# EAGLE design maple-jtagadapter (EAGLE 5.10)
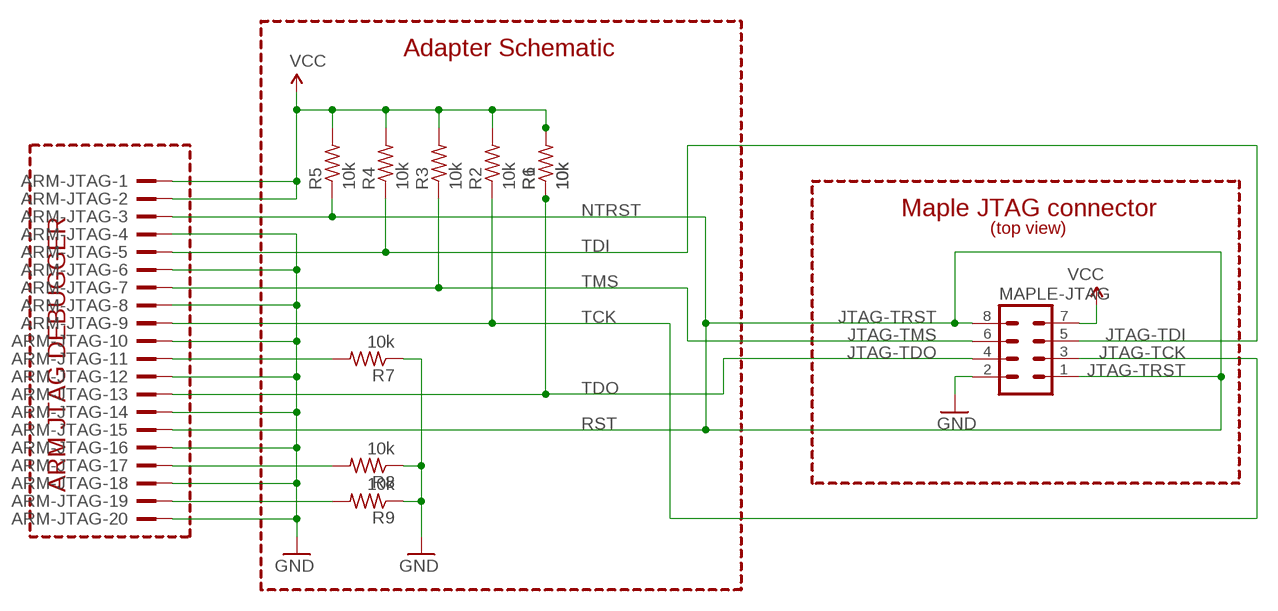
[diagram p0: schematic, sheet 1]

## Parts
ARM-JTAG  2520-  [PAK100/2500-20]
MAPLE-JTAG  MA04-2  [MA04-2]
R1  10k  R-US_0207/10  [0207/10]
R2  10k  R-US_0207/10  [0207/10]
R3  10k  R-US_0207/10  [0207/10]
R4  10k  R-US_0207/10  [0207/10]
R5  10k  R-US_0207/10  [0207/10]
R6  10k  R-US_0207/10  [0207/10]
R7  10k  R-US_0207/10  [0207/10]
R8  10k  R-US_0207/10  [0207/10]
R9  10k  R-US_0207/10  [0207/10]

## Nets
GND [vcc]: ARM-JTAG.4 ARM-JTAG.6 ARM-JTAG.8 ARM-JTAG.10 ARM-JTAG.12 ARM-JTAG.14 ARM-JTAG.16 ARM-JTAG.18 ARM-JTAG.20 MAPLE-JTAG.2 R7.1 R8.1 R9.1
JTAG-TCK: ARM-JTAG.9 MAPLE-JTAG.3 R2.1
JTAG-TDI: ARM-JTAG.5 MAPLE-JTAG.5 R4.1
JTAG-TDO: ARM-JTAG.13 MAPLE-JTAG.4 R1.1 R6.1
JTAG-TMS: ARM-JTAG.7 MAPLE-JTAG.6 R3.1
JTAG-TRST: ARM-JTAG.3 ARM-JTAG.15 MAPLE-JTAG.1 MAPLE-JTAG.8 R5.1
N$140: ARM-JTAG.11 R7.2
N$141: ARM-JTAG.17 R8.2
N$142: ARM-JTAG.19 R9.2
VCC: ARM-JTAG.1 ARM-JTAG.2 MAPLE-JTAG.7 R1.2 R2.2 R3.2 R4.2 R5.2 R6.2

## Notes on the sheet
- Adapter Schematic
- ARM JTAG DEBUGGER | NTRST | Maple JTAG connector
- (top view)
- TDI
- TMS
- TCK
- TDO
- RST

## Library data of the parts
ARM-JTAG = con-3m:2520-: 3M (TM) Pak 100 4-Wall Header Source: 3M
MAPLE-JTAG = con-lstb:MA04-2: PIN HEADER
R1-R9 = resistor:R-US_: RESISTOR, American symbol

## Net classes
0 default: width 0.203 mm
1 vcc: width 0.254 mm

## Board
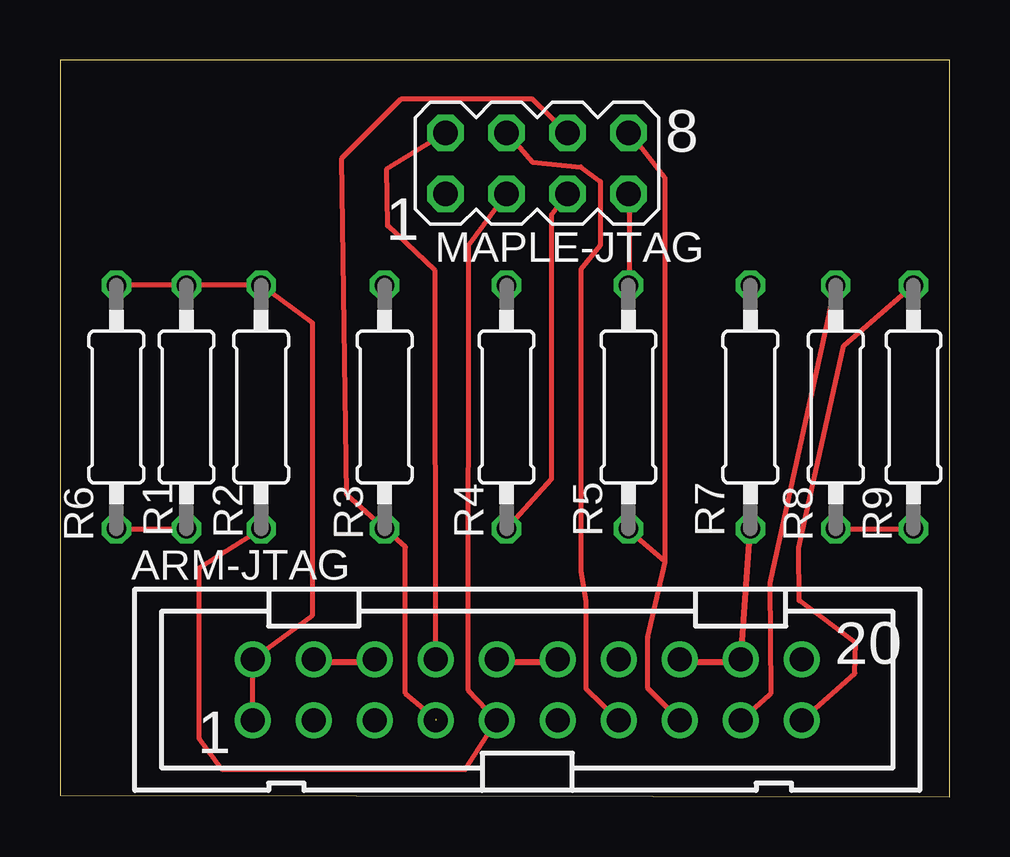
[diagram p1: board, top side]
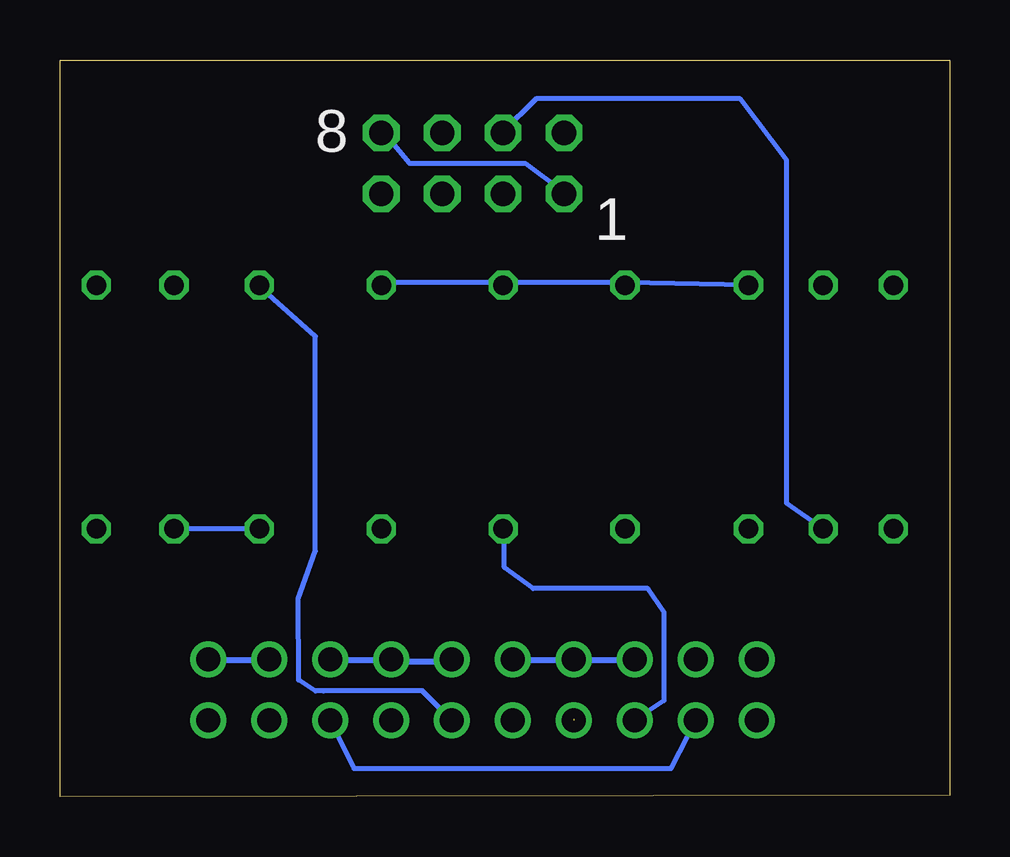
[diagram p2: board, bottom side, seen from below]

Size 37.07 x 30.72 mm. Coordinates in mm from the lower left corner, seen from the top.
Outline: 0,0.06 37.07,0 37.07,30.72 0,30.72 0,0.06
Copper layers (1*16): Top 0.0356mm / dielectric 1.5011mm / Bottom 0.0356mm
Design rules "LaenPCBOrder": minimum track width 6mil, minimum drill 13mil, track to track 6mil, track to pad 6mil, pad to pad 6mil, via to via 6mil, smd to smd 6mil, copper to edge 15mil, drill to drill 6mil, minimum pad ring 7mil, minimum via ring 7mil, stop-mask expansion 4mil, vias tented up to drill 0mil, thermal gap 10mil

### Footprints (pad centres in the part's own frame; a part is rotated, then mirrored left to right if it is on the bottom)
PAK100/2500-20 = drill 1 pad 1.422 round: 1 -11.43,-1.27; 2 -11.43,1.27; 3 -8.89,-1.27; 4 -8.89,1.27; 5 -6.35,-1.27; 6 -6.35,1.27; 7 -3.81,-1.27; 8 -3.81,1.27; 9 -1.27,-1.27; 10 -1.27,1.27; 11 1.27,-1.27; 12 1.27,1.27; 13 3.81,-1.27; 14 3.81,1.27; 15 6.35,-1.27; 16 6.35,1.27; 17 8.89,-1.27; 18 8.89,1.27; 19 11.43,-1.27; 20 11.43,1.27
MA04-2 = drill 1.016 octagon: 1 -3.81,-1.27; 2 -3.81,1.27; 3 -1.27,-1.27; 4 -1.27,1.27; 5 1.27,-1.27; 6 1.27,1.27; 7 3.81,-1.27; 8 3.81,1.27
0207/10 = drill 0.813 octagon: 1 -5.08,0; 2 5.08,0

### Placement (x,y rotation side)
ARM-JTAG  19.47,4.47 0 top
MAPLE-JTAG  19.88,26.42 0 top
R1  5.27,16.26 90 top
R2  8.38,16.26 90 top
R3  13.53,16.26 90 top
R4  18.61,16.26 90 top
R5  23.69,16.26 90 top
R6  2.35,16.26 90 top
R7  28.77,16.26 90 top
R8  32.32,16.26 90 top
R9  35.56,16.26 90 top

### Tracks (layer width: path | path; a pad name or v marks a point on that pad's centre or on a via)
GND
  Top 0.203: MAPLE-JTAG.2 13.61,26.18 13.65,23.82 15.63,21.93 ARM-JTAG.8 | R8.1 R9.1
  Top 0.254: 28.36,5.64 25.92,5.64 ARM-JTAG.16 | ARM-JTAG.4 10.68,5.64 13.12,5.64 ARM-JTAG.6 | ARM-JTAG.12 20.54,5.64 18.5,5.64 ARM-JTAG.10 | 28.36,5.64 R7.1 | 28.36,5.64 ARM-JTAG.18
  Bottom 0.203: R7.1 R8.1
  Bottom 0.254: ARM-JTAG.16 25.79,5.69 23.36,5.69 ARM-JTAG.14 23.2,5.63 20.76,5.63 ARM-JTAG.12 | ARM-JTAG.20 30.82,5.69 28.38,5.69 ARM-JTAG.18 | ARM-JTAG.10 18.17,5.69 15.74,5.69 ARM-JTAG.8 15.58,5.69 13.14,5.69 ARM-JTAG.6
JTAG-TCK
  Top 0.203: R2.1 5.8,9.55 5.8,2.43 6.73,1.16 16.89,1.14 ARM-JTAG.9 17.02,4.45 17.03,23 MAPLE-JTAG.3
JTAG-TDI
  Top 0.203: 18.71,11.23 R4.1 20.49,13.26 20.49,24.28 MAPLE-JTAG.5
  Bottom 0.203: ARM-JTAG.5 13.08,3.23 11.9,4.03 11.9,7.7 12.57,8.69 17.36,8.69 18.55,9.56 18.55,11.07 R4.1
JTAG-TDO
  Top 0.203: ARM-JTAG.13 21.91,4.52 21.91,8.18 21.7,9.4 21.7,22 22.52,23.01 22.52,25.65 21.7,26.26 19.67,26.47 MAPLE-JTAG.4 | R6.1 R1.1
  Bottom 0.203: MAPLE-JTAG.4 18.66,27.69 17.23,29.11 8.73,29.11 6.79,26.54 6.79,12.24 R1.1
JTAG-TMS  (1 unrouted)
  Top 0.203: 15.66,3.25 14.39,4.32 14.39,10.41 R3.1 11.95,12.6 11.75,26.63 14.23,29.11 19.67,29.11 MAPLE-JTAG.6
JTAG-TRST
  Top 0.203: 25.21,9.8 24.5,6.65 24.5,4.52 ARM-JTAG.15 | 25.21,9.8 23.74,11.07 R5.1 | 25.21,9.8 25.21,25.81 23.74,27.69 MAPLE-JTAG.8
  Bottom 0.203: MAPLE-JTAG.1 16.12,25.25 17.69,26.42 22.52,26.42 23.58,27.69 MAPLE-JTAG.8 | ARM-JTAG.3 11.62,1.18 24.82,1.18 ARM-JTAG.15
N$140
  Bottom 0.203: R7.2 28.77,21.29 26.43,19.2 26.43,10.25 27.15,8.27 27.13,4.88 26.43,4.42 26.09,4.42 21.97,4.43 ARM-JTAG.11
N$141
  Top 0.203: R8.2 29.59,8.91 29.63,4.32 29.58,4.27 ARM-JTAG.17
N$142
  Top 0.203: R9.2 32.66,18.81 30.77,10.38 30.8,8.19 33.15,6.41 33.12,5.16 ARM-JTAG.19
VCC
  Top 0.203: MAPLE-JTAG.7 23.74,25.09 23.74,21.44 R5.2 | R3.2 13.53,21.44 | ARM-JTAG.1 ARM-JTAG.2 10.53,7.57 10.53,19.76 R2.2 R1.2 R6.2
  Bottom 0.203: R5.2 23.58,21.44 18.71,21.44 R4.2 18.55,21.44 13.53,21.44 | 13.53,21.44 R3.2 | R2.2 13.53,21.44

### Text on the board
tNames: 8 | 1 | 20 | 1
bNames: 8 | 1
tValues: Maple | JTAG | Adapter | r1